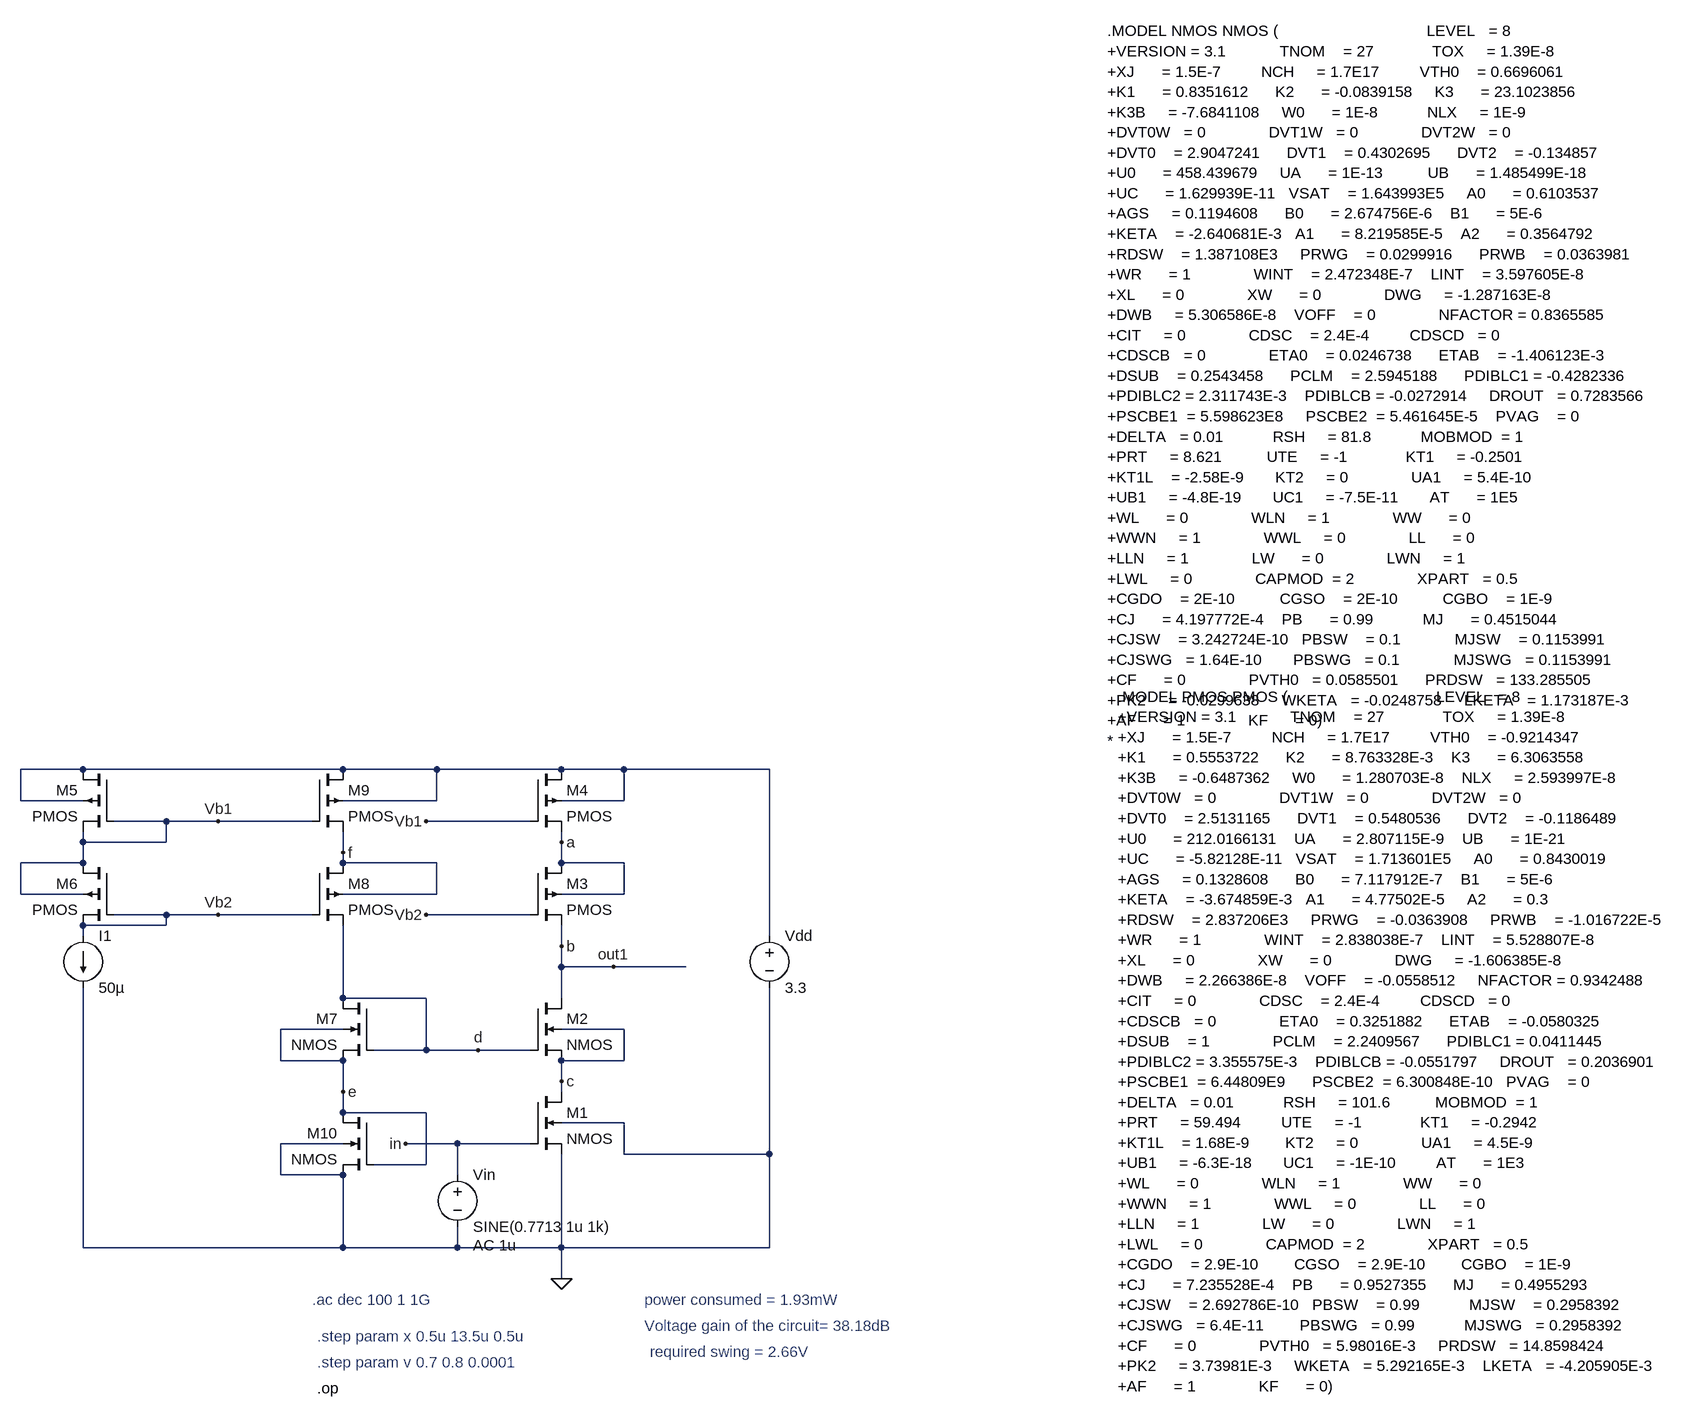
[diagram p0: schematic MosfetCM.asc]
MosfetCM.asc, the LTspice schematic file:
Version 4
SHEET 1 2708 952
WIRE -1264 -96 -1360 -96
WIRE -864 -96 -1264 -96
WIRE -720 -96 -864 -96
WIRE -528 -96 -720 -96
WIRE -432 -96 -528 -96
WIRE -208 -96 -432 -96
WIRE -1360 -48 -1360 -96
WIRE -1264 -48 -1360 -48
WIRE -720 -48 -720 -96
WIRE -720 -48 -864 -48
WIRE -432 -48 -432 -96
WIRE -432 -48 -528 -48
WIRE -1136 -16 -1216 -16
WIRE -1056 -16 -1136 -16
WIRE -912 -16 -1056 -16
WIRE -576 -16 -736 -16
WIRE -1264 16 -1264 0
WIRE -1136 16 -1136 -16
WIRE -1136 16 -1264 16
WIRE -528 16 -528 0
WIRE -864 32 -864 0
WIRE -1264 48 -1264 16
WIRE -1264 48 -1360 48
WIRE -864 48 -864 32
WIRE -720 48 -864 48
WIRE -528 48 -528 16
WIRE -432 48 -528 48
WIRE -1360 96 -1360 48
WIRE -1264 96 -1360 96
WIRE -720 96 -720 48
WIRE -720 96 -864 96
WIRE -432 96 -432 48
WIRE -432 96 -528 96
WIRE -1136 128 -1216 128
WIRE -1056 128 -1136 128
WIRE -912 128 -1056 128
WIRE -576 128 -736 128
WIRE -1136 144 -1136 128
WIRE -1136 144 -1264 144
WIRE -1264 160 -1264 144
WIRE -208 160 -208 -96
WIRE -528 176 -528 144
WIRE -528 208 -528 176
WIRE -448 208 -528 208
WIRE -336 208 -448 208
WIRE -864 256 -864 144
WIRE -736 256 -864 256
WIRE -528 256 -528 208
WIRE -864 304 -960 304
WIRE -432 304 -528 304
WIRE -736 336 -736 256
WIRE -736 336 -816 336
WIRE -656 336 -736 336
WIRE -576 336 -656 336
WIRE -960 352 -960 304
WIRE -864 352 -960 352
WIRE -528 352 -528 336
WIRE -432 352 -432 304
WIRE -432 352 -528 352
WIRE -528 384 -528 352
WIRE -864 400 -864 352
WIRE -528 400 -528 384
WIRE -864 432 -864 400
WIRE -736 432 -864 432
WIRE -432 448 -528 448
WIRE -864 480 -960 480
WIRE -688 480 -768 480
WIRE -576 480 -688 480
WIRE -432 496 -432 448
WIRE -208 496 -208 240
WIRE -208 496 -432 496
WIRE -736 512 -736 432
WIRE -736 512 -816 512
WIRE -960 528 -960 480
WIRE -864 528 -960 528
WIRE -688 528 -688 480
WIRE -1264 640 -1264 240
WIRE -864 640 -864 528
WIRE -864 640 -1264 640
WIRE -688 640 -688 608
WIRE -688 640 -864 640
WIRE -528 640 -528 496
WIRE -528 640 -688 640
WIRE -208 640 -208 496
WIRE -208 640 -528 640
WIRE -528 688 -528 640
FLAG -528 688 0
FLAG -768 480 in
FLAG -1056 -16 Vb1
FLAG -1056 128 Vb2
FLAG -736 -16 Vb1
FLAG -736 128 Vb2
FLAG -528 16 a
FLAG -528 176 b
FLAG -528 384 c
FLAG -656 336 d
FLAG -448 208 out1
FLAG -864 400 e
FLAG -864 32 f
SYMBOL nmos4 -576 400 R0
SYMATTR InstName M1
SYMATTR Value2 l=0.6u w=172u
SYMBOL nmos4 -576 256 R0
SYMATTR InstName M2
SYMATTR Value2 l=0.6u w=172u
SYMBOL pmos4 -576 48 R0
SYMATTR InstName M3
SYMATTR Value2 l=0.6u w=172u
SYMBOL pmos4 -576 -96 R0
SYMATTR InstName M4
SYMATTR Value2 l=0.6u w=172u
SYMBOL voltage -208 144 R0
SYMATTR InstName Vdd
SYMATTR Value 3.3
SYMBOL voltage -688 512 R0
WINDOW 123 24 124 Left 2
WINDOW 39 0 0 Left 0
SYMATTR Value2 AC 1u
SYMATTR InstName Vin
SYMATTR Value SINE(0.7713 1u 1k)
SYMBOL pmos4 -1216 -96 M0
SYMATTR InstName M5
SYMATTR Value2 l=0.6u w=18u
SYMBOL pmos4 -1216 48 M0
SYMATTR InstName M6
SYMATTR Value2 l=0.6u w=18u
SYMBOL nmos4 -816 256 M0
SYMATTR InstName M7
SYMATTR Value2 l=0.6u w=24u
SYMBOL current -1264 160 R0
WINDOW 123 0 0 Left 0
WINDOW 39 0 0 Left 0
SYMATTR InstName I1
SYMATTR Value 50µ
SYMBOL pmos4 -912 48 R0
SYMATTR InstName M8
SYMATTR Value2 l=0.6u w=24u
SYMBOL pmos4 -912 -96 R0
SYMATTR InstName M9
SYMATTR Value2 l=0.6u w=24u
SYMBOL nmos4 -816 432 M0
SYMATTR InstName M10
SYMATTR Value2 l=0.6u w=24u
TEXT 312 -1232 Left 2 !.MODEL NMOS NMOS (                                 LEVEL   = 8\n+VERSION = 3.1            TNOM    = 27             TOX     = 1.39E-8\n+XJ      = 1.5E-7         NCH     = 1.7E17         VTH0    = 0.6696061\n+K1      = 0.8351612      K2      = -0.0839158     K3      = 23.1023856\n+K3B     = -7.6841108     W0      = 1E-8           NLX     = 1E-9\n+DVT0W   = 0              DVT1W   = 0              DVT2W   = 0\n+DVT0    = 2.9047241      DVT1    = 0.4302695      DVT2    = -0.134857\n+U0      = 458.439679     UA      = 1E-13          UB      = 1.485499E-18\n+UC      = 1.629939E-11   VSAT    = 1.643993E5     A0      = 0.6103537\n+AGS     = 0.1194608      B0      = 2.674756E-6    B1      = 5E-6\n+KETA    = -2.640681E-3   A1      = 8.219585E-5    A2      = 0.3564792\n+RDSW    = 1.387108E3     PRWG    = 0.0299916      PRWB    = 0.0363981\n+WR      = 1              WINT    = 2.472348E-7    LINT    = 3.597605E-8\n+XL      = 0              XW      = 0              DWG     = -1.287163E-8\n+DWB     = 5.306586E-8    VOFF    = 0              NFACTOR = 0.8365585\n+CIT     = 0              CDSC    = 2.4E-4         CDSCD   = 0\n+CDSCB   = 0              ETA0    = 0.0246738      ETAB    = -1.406123E-3\n+DSUB    = 0.2543458      PCLM    = 2.5945188      PDIBLC1 = -0.4282336\n+PDIBLC2 = 2.311743E-3    PDIBLCB = -0.0272914     DROUT   = 0.7283566\n+PSCBE1  = 5.598623E8     PSCBE2  = 5.461645E-5    PVAG    = 0\n+DELTA   = 0.01           RSH     = 81.8           MOBMOD  = 1\n+PRT     = 8.621          UTE     = -1             KT1     = -0.2501\n+KT1L    = -2.58E-9       KT2     = 0              UA1     = 5.4E-10\n+UB1     = -4.8E-19       UC1     = -7.5E-11       AT      = 1E5\n+WL      = 0              WLN     = 1              WW      = 0\n+WWN     = 1              WWL     = 0              LL      = 0\n+LLN     = 1              LW      = 0              LWN     = 1\n+LWL     = 0              CAPMOD  = 2              XPART   = 0.5\n+CGDO    = 2E-10          CGSO    = 2E-10          CGBO    = 1E-9\n+CJ      = 4.197772E-4    PB      = 0.99           MJ      = 0.4515044\n+CJSW    = 3.242724E-10   PBSW    = 0.1            MJSW    = 0.1153991\n+CJSWG   = 1.64E-10       PBSWG   = 0.1            MJSWG   = 0.1153991\n+CF      = 0              PVTH0   = 0.0585501      PRDSW   = 133.285505\n+PK2     = -0.0299638     WKETA   = -0.0248758     LKETA   = 1.173187E-3\n+AF      = 1              KF      = 0)\n*
TEXT -912 720 Left 2 ;.ac dec 100 1 1G
TEXT -904 776 Left 2 ;.step param x 0.5u 13.5u 0.5u
TEXT -904 856 Left 2 !.op
TEXT -904 816 Left 2 ;.step param v 0.7 0.8 0.0001
TEXT 328 -208 Left 2 !.MODEL PMOS PMOS (                                 LEVEL   = 8\n+VERSION = 3.1            TNOM    = 27             TOX     = 1.39E-8\n+XJ      = 1.5E-7         NCH     = 1.7E17         VTH0    = -0.9214347\n+K1      = 0.5553722      K2      = 8.763328E-3    K3      = 6.3063558\n+K3B     = -0.6487362     W0      = 1.280703E-8    NLX     = 2.593997E-8\n+DVT0W   = 0              DVT1W   = 0              DVT2W   = 0\n+DVT0    = 2.5131165      DVT1    = 0.5480536      DVT2    = -0.1186489\n+U0      = 212.0166131    UA      = 2.807115E-9    UB      = 1E-21\n+UC      = -5.82128E-11   VSAT    = 1.713601E5     A0      = 0.8430019\n+AGS     = 0.1328608      B0      = 7.117912E-7    B1      = 5E-6\n+KETA    = -3.674859E-3   A1      = 4.77502E-5     A2      = 0.3\n+RDSW    = 2.837206E3     PRWG    = -0.0363908     PRWB    = -1.016722E-5\n+WR      = 1              WINT    = 2.838038E-7    LINT    = 5.528807E-8\n+XL      = 0              XW      = 0              DWG     = -1.606385E-8\n+DWB     = 2.266386E-8    VOFF    = -0.0558512     NFACTOR = 0.9342488\n+CIT     = 0              CDSC    = 2.4E-4         CDSCD   = 0\n+CDSCB   = 0              ETA0    = 0.3251882      ETAB    = -0.0580325\n+DSUB    = 1              PCLM    = 2.2409567      PDIBLC1 = 0.0411445\n+PDIBLC2 = 3.355575E-3    PDIBLCB = -0.0551797     DROUT   = 0.2036901\n+PSCBE1  = 6.44809E9      PSCBE2  = 6.300848E-10   PVAG    = 0\n+DELTA   = 0.01           RSH     = 101.6          MOBMOD  = 1\n+PRT     = 59.494         UTE     = -1             KT1     = -0.2942\n+KT1L    = 1.68E-9        KT2     = 0              UA1     = 4.5E-9\n+UB1     = -6.3E-18       UC1     = -1E-10         AT      = 1E3\n+WL      = 0              WLN     = 1              WW      = 0\n+WWN     = 1              WWL     = 0              LL      = 0\n+LLN     = 1              LW      = 0              LWN     = 1\n+LWL     = 0              CAPMOD  = 2              XPART   = 0.5\n+CGDO    = 2.9E-10        CGSO    = 2.9E-10        CGBO    = 1E-9\n+CJ      = 7.235528E-4    PB      = 0.9527355      MJ      = 0.4955293\n+CJSW    = 2.692786E-10   PBSW    = 0.99           MJSW    = 0.2958392\n+CJSWG   = 6.4E-11        PBSWG   = 0.99           MJSWG   = 0.2958392\n+CF      = 0              PVTH0   = 5.98016E-3     PRDSW   = 14.8598424\n+PK2     = 3.73981E-3     WKETA   = 5.292165E-3    LKETA   = -4.205905E-3 \n+AF      = 1              KF      = 0)
TEXT -400 720 Left 2 ;power consumed = 1.93mW
TEXT -400 760 Left 2 ;Voltage gain of the circuit= 38.18dB
TEXT -392 800 Left 2 ;required swing = 2.66V

The netlist it stands for:
* MosfetCM.asc
M1 c in 0 0 NMOS l=0.6u w=172u
M2 out1 d c c NMOS l=0.6u w=172u
M3 a Vb2 out1 a PMOS l=0.6u w=172u
M4 N001 Vb1 a N001 PMOS l=0.6u w=172u
Vdd N001 0 3.3
Vin in 0 SINE(0.7713 1u 1k) AC 1u
M5 N001 Vb1 Vb1 N001 PMOS l=0.6u w=18u
M6 Vb1 Vb2 Vb2 Vb1 PMOS l=0.6u w=18u
M7 d d e e NMOS l=0.6u w=24u
I1 Vb2 0 50µ
M8 f Vb2 d f PMOS l=0.6u w=24u
M9 N001 Vb1 f N001 PMOS l=0.6u w=24u
M10 e e 0 0 NMOS l=0.6u w=24u
.model NMOS NMOS
.model PMOS PMOS
.lib standard.mos
.MODEL NMOS NMOS (                                 LEVEL   = 8
+VERSION = 3.1            TNOM    = 27             TOX     = 1.39E-8
+XJ      = 1.5E-7         NCH     = 1.7E17         VTH0    = 0.6696061
+K1      = 0.8351612      K2      = -0.0839158     K3      = 23.1023856
+K3B     = -7.6841108     W0      = 1E-8           NLX     = 1E-9
+DVT0W   = 0              DVT1W   = 0              DVT2W   = 0
+DVT0    = 2.9047241      DVT1    = 0.4302695      DVT2    = -0.134857
+U0      = 458.439679     UA      = 1E-13          UB      = 1.485499E-18
+UC      = 1.629939E-11   VSAT    = 1.643993E5     A0      = 0.6103537
+AGS     = 0.1194608      B0      = 2.674756E-6    B1      = 5E-6
+KETA    = -2.640681E-3   A1      = 8.219585E-5    A2      = 0.3564792
+RDSW    = 1.387108E3     PRWG    = 0.0299916      PRWB    = 0.0363981
+WR      = 1              WINT    = 2.472348E-7    LINT    = 3.597605E-8
+XL      = 0              XW      = 0              DWG     = -1.287163E-8
+DWB     = 5.306586E-8    VOFF    = 0              NFACTOR = 0.8365585
+CIT     = 0              CDSC    = 2.4E-4         CDSCD   = 0
+CDSCB   = 0              ETA0    = 0.0246738      ETAB    = -1.406123E-3
+DSUB    = 0.2543458      PCLM    = 2.5945188      PDIBLC1 = -0.4282336
+PDIBLC2 = 2.311743E-3    PDIBLCB = -0.0272914     DROUT   = 0.7283566
+PSCBE1  = 5.598623E8     PSCBE2  = 5.461645E-5    PVAG    = 0
+DELTA   = 0.01           RSH     = 81.8           MOBMOD  = 1
+PRT     = 8.621          UTE     = -1             KT1     = -0.2501
+KT1L    = -2.58E-9       KT2     = 0              UA1     = 5.4E-10
+UB1     = -4.8E-19       UC1     = -7.5E-11       AT      = 1E5
+WL      = 0              WLN     = 1              WW      = 0
+WWN     = 1              WWL     = 0              LL      = 0
+LLN     = 1              LW      = 0              LWN     = 1
+LWL     = 0              CAPMOD  = 2              XPART   = 0.5
+CGDO    = 2E-10          CGSO    = 2E-10          CGBO    = 1E-9
+CJ      = 4.197772E-4    PB      = 0.99           MJ      = 0.4515044
+CJSW    = 3.242724E-10   PBSW    = 0.1            MJSW    = 0.1153991
+CJSWG   = 1.64E-10       PBSWG   = 0.1            MJSWG   = 0.1153991
+CF      = 0              PVTH0   = 0.0585501      PRDSW   = 133.285505
+PK2     = -0.0299638     WKETA   = -0.0248758     LKETA   = 1.173187E-3
+AF      = 1              KF      = 0)
*
* .ac dec 100 1 1G
* .step param x 0.5u 13.5u 0.5u
.op
* .step param v 0.7 0.8 0.0001
.MODEL PMOS PMOS (                                 LEVEL   = 8
+VERSION = 3.1            TNOM    = 27             TOX     = 1.39E-8
+XJ      = 1.5E-7         NCH     = 1.7E17         VTH0    = -0.9214347
+K1      = 0.5553722      K2      = 8.763328E-3    K3      = 6.3063558
+K3B     = -0.6487362     W0      = 1.280703E-8    NLX     = 2.593997E-8
+DVT0W   = 0              DVT1W   = 0              DVT2W   = 0
+DVT0    = 2.5131165      DVT1    = 0.5480536      DVT2    = -0.1186489
+U0      = 212.0166131    UA      = 2.807115E-9    UB      = 1E-21
+UC      = -5.82128E-11   VSAT    = 1.713601E5     A0      = 0.8430019
+AGS     = 0.1328608      B0      = 7.117912E-7    B1      = 5E-6
+KETA    = -3.674859E-3   A1      = 4.77502E-5     A2      = 0.3
+RDSW    = 2.837206E3     PRWG    = -0.0363908     PRWB    = -1.016722E-5
+WR      = 1              WINT    = 2.838038E-7    LINT    = 5.528807E-8
+XL      = 0              XW      = 0              DWG     = -1.606385E-8
+DWB     = 2.266386E-8    VOFF    = -0.0558512     NFACTOR = 0.9342488
+CIT     = 0              CDSC    = 2.4E-4         CDSCD   = 0
+CDSCB   = 0              ETA0    = 0.3251882      ETAB    = -0.0580325
+DSUB    = 1              PCLM    = 2.2409567      PDIBLC1 = 0.0411445
+PDIBLC2 = 3.355575E-3    PDIBLCB = -0.0551797     DROUT   = 0.2036901
+PSCBE1  = 6.44809E9      PSCBE2  = 6.300848E-10   PVAG    = 0
+DELTA   = 0.01           RSH     = 101.6          MOBMOD  = 1
+PRT     = 59.494         UTE     = -1             KT1     = -0.2942
+KT1L    = 1.68E-9        KT2     = 0              UA1     = 4.5E-9
+UB1     = -6.3E-18       UC1     = -1E-10         AT      = 1E3
+WL      = 0              WLN     = 1              WW      = 0
+WWN     = 1              WWL     = 0              LL      = 0
+LLN     = 1              LW      = 0              LWN     = 1
+LWL     = 0              CAPMOD  = 2              XPART   = 0.5
+CGDO    = 2.9E-10        CGSO    = 2.9E-10        CGBO    = 1E-9
+CJ      = 7.235528E-4    PB      = 0.9527355      MJ      = 0.4955293
+CJSW    = 2.692786E-10   PBSW    = 0.99           MJSW    = 0.2958392
+CJSWG   = 6.4E-11        PBSWG   = 0.99           MJSWG   = 0.2958392
+CF      = 0              PVTH0   = 5.98016E-3     PRDSW   = 14.8598424
+PK2     = 3.73981E-3     WKETA   = 5.292165E-3    LKETA   = -4.205905E-3
+AF      = 1              KF      = 0)
* power consumed = 1.93mW
* Voltage gain of the circuit= 38.18dB
* required swing = 2.66V
.backanno
.end